# Altium schematic sheet AD9363 OSCILLATORS.SchDoc
size A3; SheetNumber: 13; SheetTotal: 14
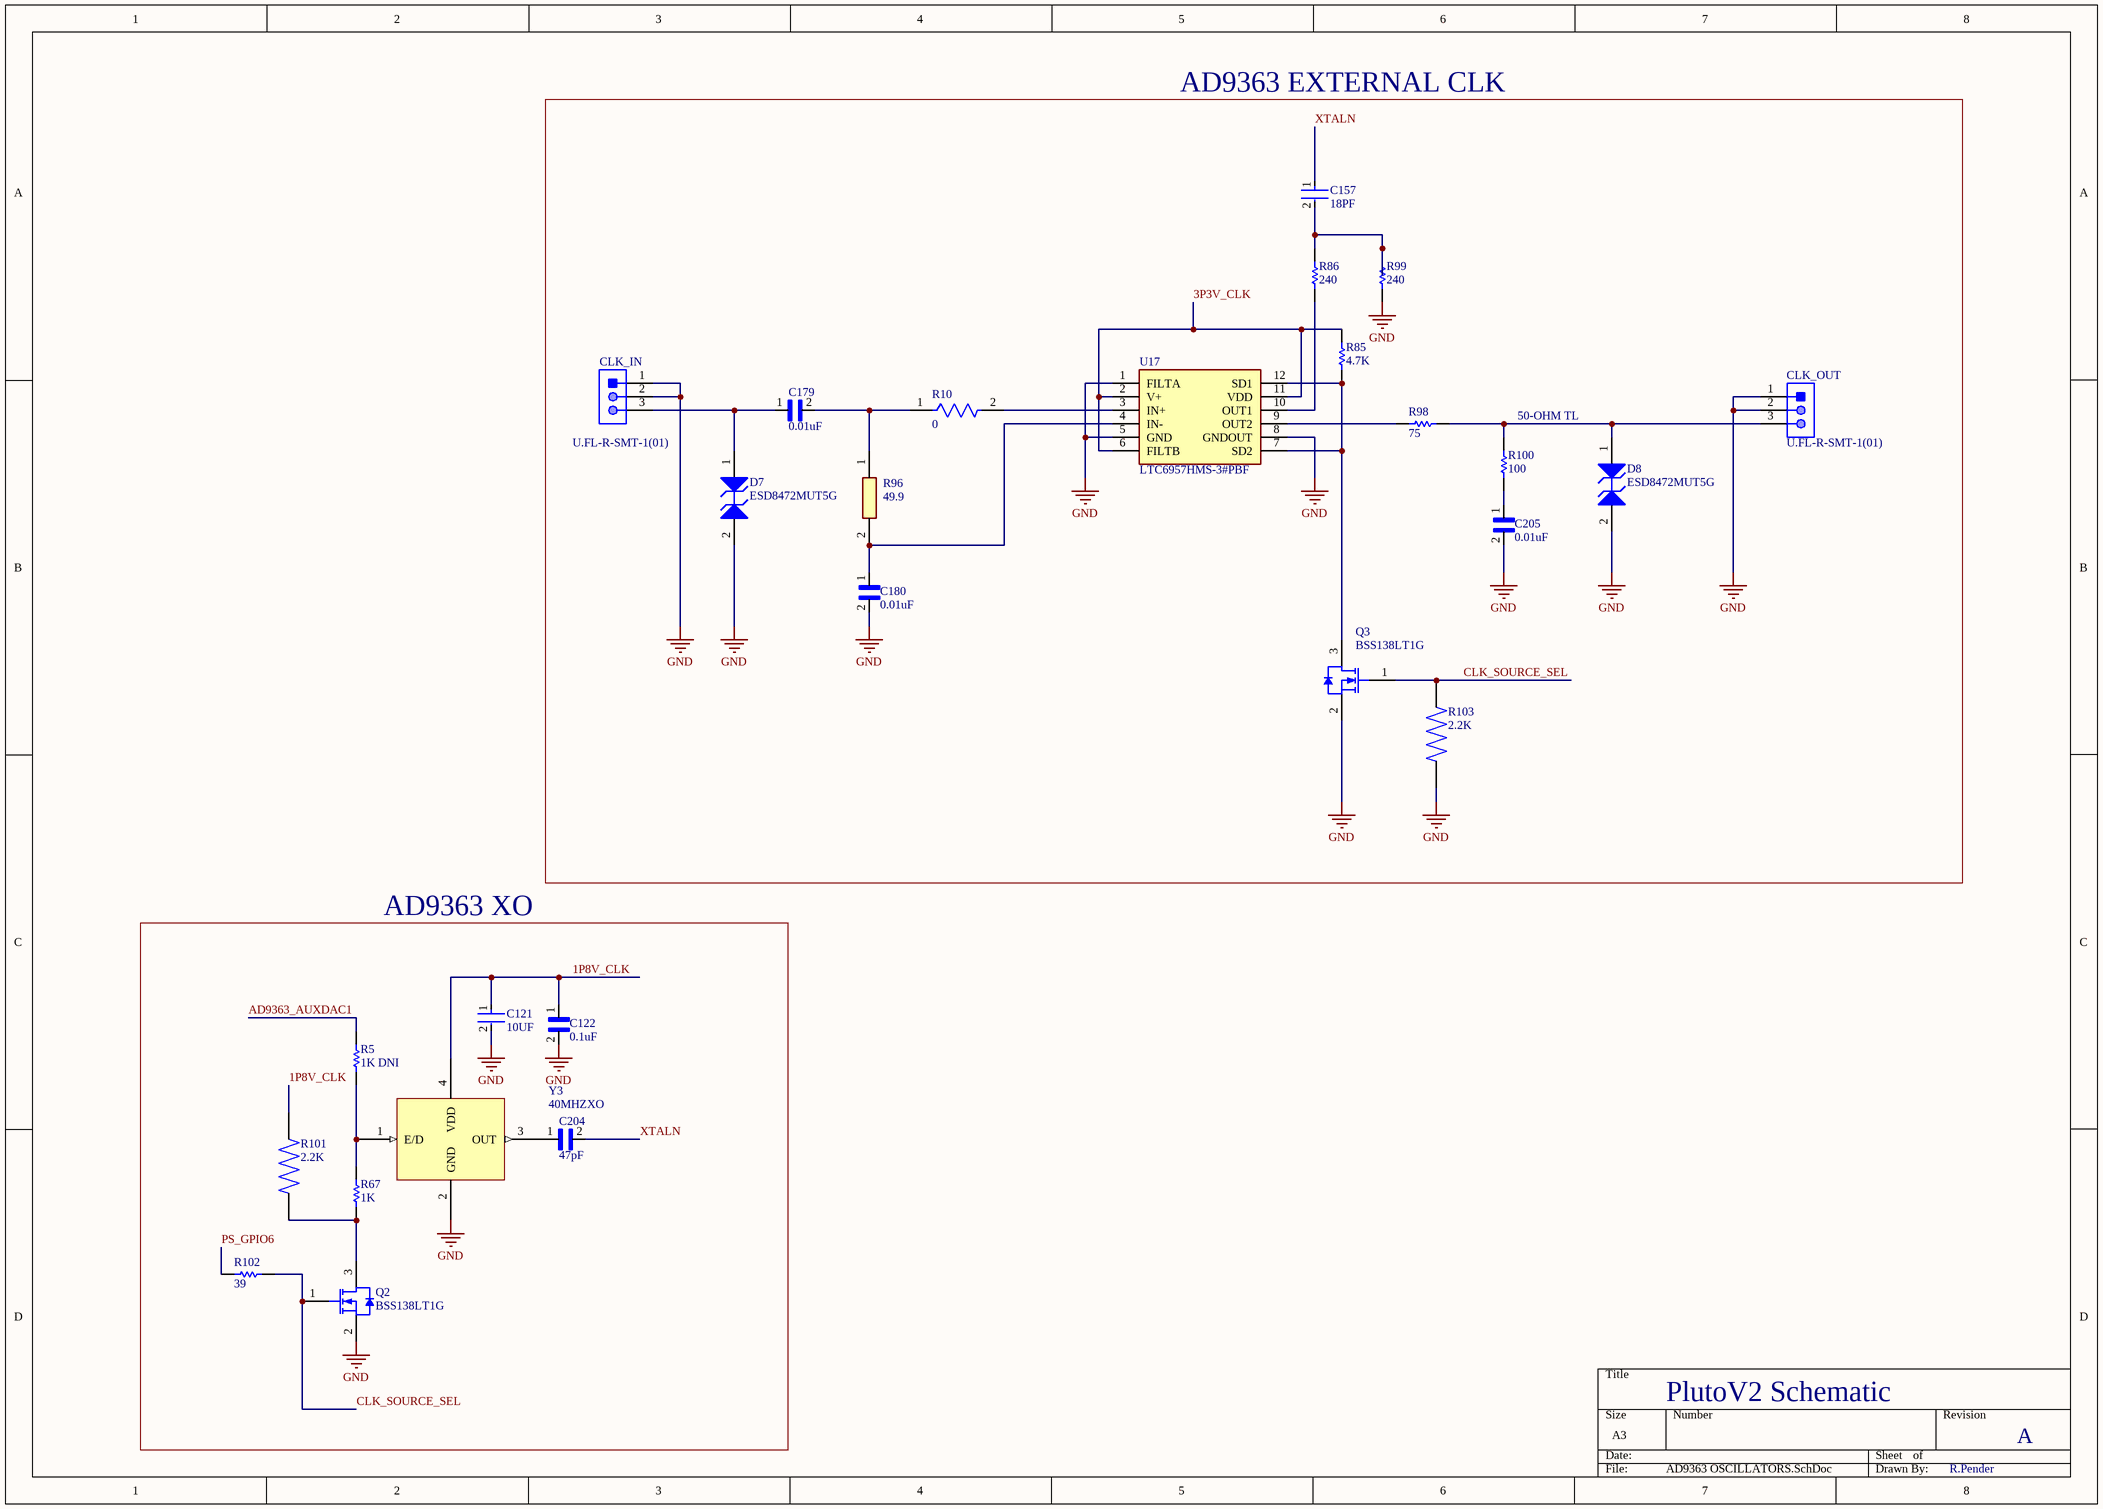
[diagram p0: AD9363 OSCILLATORS.SchDoc]

## Parts
C121  10UF  [FP-GRM188-0_1-e0_2_0_55-IPC_A]
C122  0.1uF  [CAPC0603X33N]
C157  18PF  [FP-GRM033-0_03-IPC_A]
C179  0.01uF  [CAPC0603X33N]
C180  0.01uF  [CAPC0603X33N]
C204  47pF  [CAPC1005X55N]
C205  0.01uF  [CAPC0603X33N]
CLK_IN  U.FL-R-SMT-1(01)  [HRS-U.FL-R-SMT-3_V]
CLK_OUT  U.FL-R-SMT-1(01)  [HRS-U.FL-R-SMT-3_V]
D7  ESD8472MUT5G  [ONSC-X3DFN-2-152AF-01_V]
D8  ESD8472MUT5G  [ONSC-X3DFN-2-152AF-01_V]
Q2  BSS138LT1G  [ONSC-SOT-23-3-318-08_V]
Q3  BSS138LT1G  [ONSC-SOT-23-3-318-08_V]
R5  1K DNI  [RESC0603X26X15LL03T05]
R10  0  [FP-ERJ1GN-IPC_A]
R67  1K  [2-0402]
R85  4.7K  [2-0402]
R86  240  [2-0402]
R96  49.9  [RESC1608X46N]
R98  75  [2-0402]
R99  240  [2-0402]
R100  100  [2-0402]
R101  2.2K  [RESC1005X35N]
R102  39  [2-0402]
R103  2.2K  [RESC1005X35N]
U17  LTC6957HMS-3#PBF  [SOP65P490X110-12N]
Y3  40MHZXO  [XO40MHz2]

## Blocks framed on the sheet
AD9363 EXTERNAL CLK: C157 C179 C180 C205 CLK_IN CLK_OUT D7 D8 Q3 R10 R85 R86 R96 R98-R100 R103 U17
AD9363 XO: C121 C122 C204 Q2 R5 R67 R101 R102 Y3

## Nets
GND: C121.2 C122.2 C180.2 C205.2 CLK_IN.1 CLK_IN.2 CLK_OUT.1 CLK_OUT.2 D7.2(A2) D8.2(A2) Q2.2(S) Q3.2(S) R99.1 R103.2 U17.1(FILTA) U17.5(GND) U17.8(GNDOUT) Y3.2(GND)
1P8V_CLK: C121.1 C122.1 R101.2 Y3.4(VDD)
3P3V_CLK: R85.2 U17.2(V+) U17.6(FILTB) U17.11(VDD)
AD9363_AUXDAC1: R5.1
CLK_SOURCE_SEL: Q2.1(G) Q3.1(G) R102.2 R103.1
PS_GPIO6: R102.1
XTALN: C157.1 C204.2
NetC157_2: C157.2 R86.2 R99.2
NetC179_1: C179.1 CLK_IN.3 D7.1(A1)
NetC179_2: C179.2 R10.1 R96.1
NetC180_1: C180.1 R96.2 U17.4(IN-)
NetC204_1: C204.1 Y3.3(OUT)
NetC205_1: C205.1 R100.2
NetCLK_OUT_3: CLK_OUT.3 D8.1(A1) R98.2 R100.1
NetQ2_3: Q2.3(D) R67.2 R101.1
NetQ3_3: Q3.3(D) R85.1 U17.7(SD2) U17.12(SD1)
NetR5_2: R5.2 R67.1 Y3.1(E/D)
NetR10_2: R10.2 U17.3(IN+)
NetR86_1: R86.1 U17.10(OUT1)
NetR98_1: R98.1 U17.9(OUT2)

## Notes on the sheet
- (near R100) 50-OHM TL
- PlutoV2 Schematic
- A
- R.Pender

## Library data of the parts
C121 = CMP-2006-02792-2: Chip Multilayer Ceramic Capacitors for General Purpose, 0603, 10uF, X5R, 15%, 20%, 6.3V; Packaging: Tape and Reel; Voltage Rating (DC): 6.3V; Width: 0.031inch; Termination: SMD/SMT; Dielectric: X5R; Package Quantity: 4000; Voltage Rating: 6.3V; Capacitance: 10uF; Case/Package: 0603; Min Operating Temperature: -55°C; Voltage: 6.3V; Length: 1.6mm; Thickness: 0.035inch; Lead Free: Lead Free; Depth: 0.8mm; Case Code (Imperial): 0603; Max Operating Temperature: 85°C; Material: Ceramic; Height: 0.8mm; Tolerance: 20%; Mount: Surface Mount; REACH SVHC: No SVHC; Radiation Hardening: No; Case Code (Metric): 1608
C122 = GRM033R61C104ME84D: CAP 0.1UF 16VDC X5R 20% SMD 0201 PAPER TAPE; Package: None; Price: None; Value: *; MP: GRM033R61C104ME84D; Availability: Unavailable
C157 = CMP-2010-01507-2: Chip Multilayer Ceramic Capacitors for General Purpose, 0201, 18pF, C0G, 30ppm/°C, 5%, 50V; Max Operating Temperature: 125°C; Case Code (Metric): 0603; Case Code (Imperial): 0201; Capacitance: 18pF; Voltage Rating (DC): 50V; Lead Free: Lead Free; Mount: Surface Mount; Radiation Hardening: No; Height: 0.3mm; Package Quantity: 15000; Depth: 0.3mm; Tolerance: 5%; Thickness: 0.013inch; Width: 0.3mm; Packaging: Tape and Reel; Voltage Rating: 50V; Dielectric: C0G; Length: 0.6mm; Termination: SMD/SMT; Min Operating Temperature: -55°C; Case/Package: 0201; Voltage: 50V
C179 C180 C205 = GRM033R71A103KA01D: SMD Capacitor X7R(EIA) with Capacitance: 10000pF Tol. 10%. Rated Voltage: 10Vdc; MF: Murata; Package: 0603 Taiyo Yuden; MP: GRM033R71A103KA01D; Value: *; SnapEDA_Link: https://www.snapeda.com/parts/GRM033R71A103KA01D/Murata/view-part/4379446/?ref=snap; Availability: Unavailable; Price: None; Check_prices: https://www.snapeda.com/parts/GRM033R71A103KA01D/Murata/view-part/4379446/?ref=eda
C204 = GCM1555C1H470JA16D: 47pF Â±5% 50V Ceramic Capacitor C0G, NP0 0402 (1005 Metric); MF: Murata; Purchase-URL: https://pricing.snapeda.com/search/part/GCM1555C1H470JA16D/?ref=eda; Package: 1005 Taiyo Yuden; MP: GCM1555C1H470JA16D; Value: *; SnapEDA_Link: https://www.snapeda.com/parts/GCM1555C1H470JA16D/Murata+Electronics+North+America/view-part/?ref=snap; Digi-Key_Part_Number: 490-10670-2-ND; Check_prices: https://www.snapeda.com/parts/GCM1555C1H470JA16D/Murata+Electronics+North+America/view-part/?ref=eda
CLK_IN CLK_OUT = CMP-2000-05153-1: Ultra Small Coaxial Connector, 6 GHz, -40 to 90 degC, 3-Pin SMD, RoHS, Bulk; Manufacturer: Hirose Electric; Connector Style: U.FL; Impedance: 50Ohm; Dielectric Material: LiquidCrystalPolymer(LCP); Minimum Quantity: UltraMiniatureCoaxial; Online Catalog: U.FLSeries; Featured Product: HiroseU.FLSeries; Frequency - Max: 6GHz; Other Names: H122041 / U.FL-R-SMT-1(01)-ND; Contact Termination: Solder; Body Material: PhosphorBronze; Connector Type: Jack,MalePin; Body Finish: Silver; Center Contact Plating: Gold; Manufacturer URL: https://www.hirose.com; Family: CoaxialConnectors(RF); Fastening Type: Snap-On; Unit PriceUSD: U.FL; Series: U.FL; Package Reference: U.FL-R-SMT; Packaging: Bulk; Standard Package: 100; Mounting Type: SurfaceMount; Quantity Available: Bulk; Housing Color: Silver; Package Description: 3-Pin Surface Mount Device, Body 2.6 x 2.6 mm; Category: Connectors,Interconnects; Operating Temperature: -40degC~90degC; Center Contact Material: PhosphorBronze; Dynamic Catalog: U.FLSeries; Datasheet URL: https://datasheet.ciiva.com/26945/getdatasheetpartid-475239-26945414.pdf; Datasheet Version: Feb-09; Shield Termination: Solder
D7 D8 = CMP-1063-00281-1: Ultra-Low Capacitance ESD Protection, Micro-Packaged Diode for ESD Protection, 2-Pin X3DFN, Pb-Free, Tape and Reel; Manufacturer: On Semiconductor; IR Max (uA): 0.05; C Max (pF): 0.3; V(BR) Min (V): 7; VRWM Max (V): 5.3; Number of Lines: 1; Direction: Bidirectional; PartNumber: ESD8472MUT5G; PackageVersion: Rev. O, 04/2011; RoHS: Pb-Free; PackageDescription: 2-Pin Small Outline No-Lead, Body 0.62 x 0.32 mm, Pitch 0.355 mm; ComponentLink1Description: Manufacturer URL; ComponentLink1URL: http://www.onsemi.com/; Packing: Tape and Reel; Mounting Technology: Surface Mount; PackageReference: X3DFN-2-152AF-01; ComponentLink3Description: Package Specification; ComponentLink2Description: Datasheet; ComponentLink3URL: http://www.onsemi.cn/pub_link/Collateral/152AF.PDF; DatasheetVersion: Rev. 4; ComponentLink2URL: http://www.onsemi.cn/pub_link/Collateral/ESD8472-D.PDF
Q2 Q3 = CMP-1058-00767-1: Power MOSFET, 200 mA, 50 V, N-Channel, 3-Pin SOT-23, Pb-Free, Tape and Reel; Manufacturer: On Semiconductor; PD Max (W): 0.225; Coss Typ (pF): 12; V(BR)DSS Min (V): 50; VGS Max (V): 20; Channel Polarity: N Channel; Configuration: Single; VGS(th) Max (V): 1.5; Ciss Typ (pF): 40; Crss Typ (pF): 3.5; ID Max (A): 0.2; ComponentLink3Description: Package Specification; PackageDescription: 3-Pin Small Outline Transistor, Body 2.92 x 1.3 mm, Pitch 0.95 mm; PackageReference: SOT-23-3-318-08; RoHS: Pb-Free; Mounting Technology: Surface Mount; ComponentLink1Description: Manufacturer URL; ComponentLink2URL: http://www.onsemi.com/pub_link/Collateral/BSS138LT1-D.PDF; ComponentLink2Description: Datasheet; Packing: Tape and Reel; PackageVersion: Rev. AP, 11/2009; PartNumber: BSS138LT1G; Package Type: SOT-23-3; ComponentLink1URL: http://www.onsemi.com/; DatasheetVersion: Rev. 8; ComponentLink3URL: http://www.onsemi.cn/pub_link/Collateral/318-08.PDF
R5 = CMP-2004-03448-1: Manufacturer: Panasonic; Part Number: ERJ1GNF10R0C
R10 = CMP-1010-00001-3: RES SMD 0 OHM JUMPER 1/20W 0201; Temperature Coefficient: 600ppm/°C; Max Power Dissipation: 50mW; Resistance: 0R; Voltage Rating: 25V; Tolerance: 1%; Package Quantity: 15000; Case Code (Imperial): 0201; Number of Terminations: 2; Depth: 0.3mm; Lead Free: Lead Free; Military Standard: Not; Width: 0.3mm; Series: ERJ; Max Operating Temperature: 125°C; Construction: Rectangular; Contact Plating: Tin; RoHS Compliant: Yes; Height: 0.23mm; Voltage Rating (DC): 25V; Mount: Surface Mount; Min Operating Temperature: -55°C; Power Rating: 50mW; Features: Automotive AEC-Q200; Resistor Type: Thick Film; Case/Package: 0201; Case Code (Metric): 0603; Length: 0.6mm; Packaging: Tape and Reel
R67 R85 R86 R98-R100 = ERJ2RK: Precision Thick Film Chip Resistor, 10 Ohm to 1M Ohm Range, 1% and 0.5% Tolerance, 0402 Size, 0.063 W; Published: 17-Dec-2003; LatestRevisionDate: 19-Mar-2004; LatestRevisionNote: Silkscreen size reduced.; PackageDocument: Mar-2003; PackageReference: 2-0402; Publisher: Altium Limited; Code_IPC: 1005 [0402]; ComponentLink1Description: Manufacturer Link; ComponentLink1URL: http://www.panasonic.com/industrial/components/resistive_products.htm; ComponentLink2Description: Datasheet; ComponentLink2URL: http://www.panasonic.com/industrial/components/pdf/AOA0000CE2.pdf
R96 = PCAN0603E49R9BST5: Resistor; Manufacturer_Name: Vishay; Datasheet Link: http://www.vishay.com/docs/60125/pcan.pdf; Height: 0.457mm; Manufacturer_Part_Number: PCAN0603E49R9BST5
R101 R103 = CRCW04022K20FKEDC: 2.2 kOhms Â±1% 0.063W, 1/16W Chip Resistor 0402 _1005 Metric_ Thick Film; MF: Vishay; Price: None; Package: 1005 Yageo; Availability: Unavailable; SnapEDA_Link: https://www.snapeda.com/parts/CRCW04022K20FKEDC/Vishay/view-part/4129871/?ref=snap; Value: *; MP: CRCW04022K20FKEDC
R102 = ERJ2GE: Thick Film Chip Resistor, 1 Ohm to 2.2M Ohm Range, 5% Tolerance, 0402 Size, 0.063 W; Note: If flow soldering, adjust pad width of PCB Footprint to 0.7 - 0.8 times the width of the resistor.; Published: 17-Dec-2003; LatestRevisionDate: 19-Mar-2004; LatestRevisionNote: Silkscreen size reduced.; PackageDocument: Mar-2003; PackageReference: 2-0402; Publisher: Altium Limited; Code_IPC: 1005 [0402]; ComponentLink1Description: Manufacturer Link; ComponentLink1URL: http://www.panasonic.com/industrial/components/resistive_products.htm; ComponentLink2Description: Datasheet; ComponentLink2URL: http://www.panasonic.com/industrial/components/pdf/AOA0000CE1.pdf
U17 = LTC6957HMS-3#PBF: Integrated Circuit; Manufacturer_Name: Analog Devices; Datasheet Link: https://componentsearchengine.com//LTC6957HMS-3#PBF.pdf; Height: 1.1mm; Mouser2 Part Number: 584-LTC6957HMS-3#PBF; Mouser2 Price/Stock: https://www.mouser.com/Search/Refine.aspx?Keyword=584-LTC6957HMS-3%23PBF; Manufacturer_Part_Number: LTC6957HMS-3#PBF